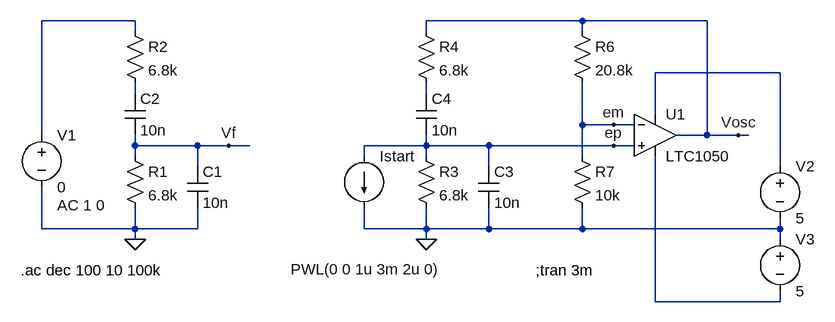
[diagram p0: schematic wien.asc]
wien.asc, the LTspice schematic file:
Version 4
SHEET 1 1276 680
WIRE 224 -80 80 -80
WIRE 912 -80 672 -80
WIRE 1104 -80 912 -80
WIRE 224 -64 224 -80
WIRE 672 -64 672 -80
WIRE 912 -64 912 -80
WIRE 1216 0 1024 0
WIRE 224 32 224 16
WIRE 672 32 672 16
WIRE 1024 64 1024 0
WIRE 912 80 912 16
WIRE 960 80 912 80
WIRE 992 80 960 80
WIRE 80 96 80 -80
WIRE 1104 96 1104 -80
WIRE 1104 96 1056 96
WIRE 1152 96 1104 96
WIRE 1168 96 1152 96
WIRE 224 112 224 96
WIRE 320 112 224 112
WIRE 368 112 320 112
WIRE 400 112 368 112
WIRE 672 112 672 96
WIRE 672 112 576 112
WIRE 768 112 672 112
WIRE 960 112 768 112
WIRE 992 112 960 112
WIRE 224 128 224 112
WIRE 576 128 576 112
WIRE 672 128 672 112
WIRE 912 128 912 80
WIRE 320 144 320 112
WIRE 768 144 768 112
WIRE 1216 144 1216 0
WIRE 80 240 80 176
WIRE 224 240 224 208
WIRE 224 240 80 240
WIRE 320 240 320 208
WIRE 320 240 224 240
WIRE 576 240 576 208
WIRE 672 240 672 208
WIRE 672 240 576 240
WIRE 768 240 768 208
WIRE 768 240 672 240
WIRE 912 240 912 208
WIRE 912 240 768 240
WIRE 1216 240 1216 224
WIRE 1216 240 912 240
WIRE 224 256 224 240
WIRE 672 256 672 240
WIRE 1216 256 1216 240
WIRE 1024 352 1024 128
WIRE 1216 352 1216 336
WIRE 1216 352 1024 352
FLAG 224 256 0
FLAG 368 112 Vf
FLAG 672 256 0
FLAG 1152 96 Vosc
FLAG 960 80 em
FLAG 960 112 ep
SYMBOL res 208 112 R0
SYMATTR InstName R1
SYMATTR Value 6.8k
SYMBOL cap 304 144 R0
SYMATTR InstName C1
SYMATTR Value 10n
SYMBOL cap 208 32 R0
SYMATTR InstName C2
SYMATTR Value 10n
SYMBOL res 208 -80 R0
SYMATTR InstName R2
SYMATTR Value 6.8k
SYMBOL voltage 80 80 R0
WINDOW 123 24 124 Left 2
WINDOW 39 0 0 Left 2
SYMATTR Value2 AC 1 0
SYMATTR InstName V1
SYMATTR Value 0
SYMBOL voltage 1216 128 R0
SYMATTR InstName V2
SYMATTR Value 5
SYMBOL Opamps\\LTC1050 1024 32 R0
SYMATTR InstName U1
SYMBOL res 656 112 R0
SYMATTR InstName R3
SYMATTR Value 6.8k
SYMBOL cap 752 144 R0
SYMATTR InstName C3
SYMATTR Value 10n
SYMBOL cap 656 32 R0
SYMATTR InstName C4
SYMATTR Value 10n
SYMBOL res 656 -80 R0
SYMATTR InstName R4
SYMATTR Value 6.8k
SYMBOL res 896 -80 R0
SYMATTR InstName R6
SYMATTR Value 20.8k
SYMBOL res 896 112 R0
SYMATTR InstName R7
SYMATTR Value 10k
SYMBOL current 576 128 R0
WINDOW 3 -113 174 Left 2
WINDOW 123 0 0 Left 2
WINDOW 39 0 0 Left 2
SYMATTR InstName Istart
SYMATTR Value PWL(0 0 1u 3m 2u 0)
SYMBOL voltage 1216 240 R0
SYMATTR InstName V3
SYMATTR Value 5
TEXT 48 304 Left 2 !.ac dec 100 10 100k
TEXT 840 304 Left 2 !;tran 3m

The netlist it stands for:
* wien.asc
R1 Vf 0 6.8k
C1 Vf 0 10n
C2 N003 Vf 10n
R2 N001 N003 6.8k
V1 N001 0 0 AC 1 0
V2 N002 0 5
XU1 ep em N002 N005 Vosc LTC1050  ; pins In+ In- V+ V- OUT
R3 ep 0 6.8k
C3 ep 0 10n
C4 N004 ep 10n
R4 Vosc N004 6.8k
R6 Vosc em 20.8k
R7 em 0 10k
Istart ep 0 PWL(0 0 1u 3m 2u 0)
V3 0 N005 5
.ac dec 100 10 100k
;tran 3m
.lib LTC.lib
.backanno
.end